# EAGLE design Transmitter PCB (EAGLE 9.6.2)
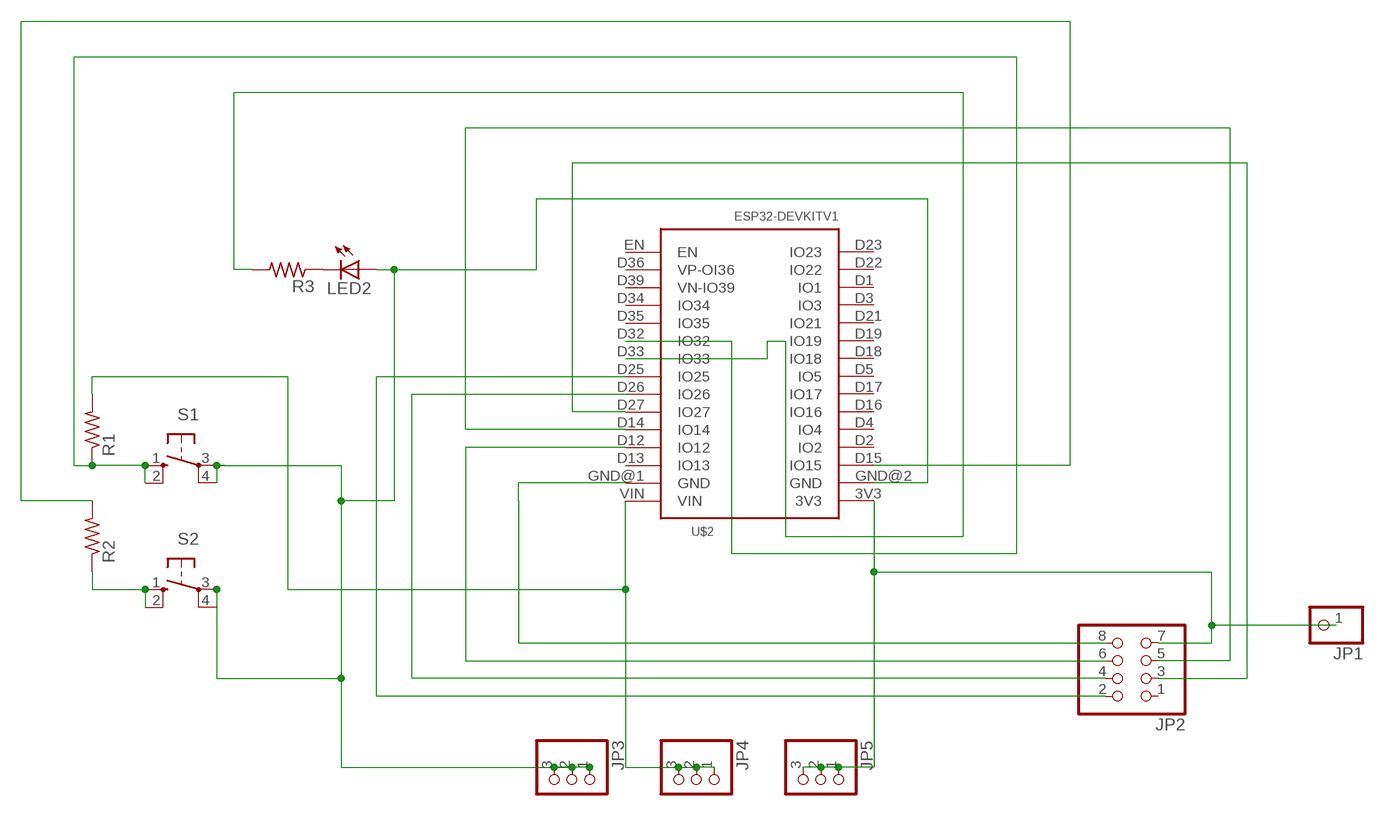
[diagram p0: schematic, sheet 1]

## Parts
JP1  PINHD-1X1  [1X01]
JP2  PINHD-2X4  [2X04]
JP3  PINHD-1X3  [1X03]
JP4  PINHD-1X3  [1X03]
JP5  PINHD-1X3  [1X03]
LED2  LED5MM  [LED5MM]
R1  R-US_0207/7  [0207/7]
R2  R-US_0207/7  [0207/7]
R3  R-US_0207/7  [0207/7]
S1  10-XX  [B3F-10XX]
S2  10-XX  [B3F-10XX]
U$2  ESP32DEVKITV1  [ESP32-DEVKITV1]

## Nets
GND: JP2.8 U$2.GND@1(GND)
LED2: R3.2 U$2.D33(IO33)
N$1: R2.1 S2.1(S) S2.2(S1)
N$2: JP3.1 JP3.2 JP3.3 LED2.A S1.3(P) S1.4(P1) S2.3(P) S2.4(P1) U$2.GND@2(GND)
N$3: JP2.4 U$2.D26(IO26)
N$4: JP2.2 U$2.D25(IO25)
N$6: JP1.1 JP2.7 JP5.1 JP5.2 JP5.3 U$2.3V3
N$7: JP2.3 U$2.D27(IO27)
N$8: LED2.K(C) R3.1
N$9: JP2.6 U$2.D12(IO12)
N$10: JP2.5 U$2.D14(IO14)
N$11: R2.2 U$2.D15(IO15)
RST: R1.1 S1.1(S) S1.2(S1) U$2.D32(IO32)
VCC: JP4.1 JP4.2 JP4.3 R1.2 U$2.VIN
Unconnected: JP2.1 U$2.D1(IO1) U$2.D2(IO2) U$2.D3(IO3) U$2.D4(IO4) U$2.D5(IO5) U$2.D13(IO13) U$2.D16(IO16) U$2.D17(IO17) U$2.D18(IO18) U$2.D19(IO19) U$2.D21(IO21) U$2.D22(IO22) U$2.D23(IO23) U$2.D34(IO34) U$2.D35(IO35) U$2.D36(VP-OI36) U$2.D39(VN-IO39) U$2.EN

## Library data of the parts
JP1 = adafruit:PINHD-1X1: Pin header 1x1 for 0.1" spacing With round pins
JP2 = adafruit:PINHD-2X4: PIN HEADER
JP3-JP5 = adafruit:PINHD-1X3: PIN HEADER
LED2 = adafruit:LED: LED OSRAM: - CHIPLED LG R971, LG N971, LY N971, LG Q971, LY Q971, LO R971, LY R971 LH N974, LH R974 LS Q976, LO Q976, LY Q976 LO Q996 - Hyper CHIPLED LW Q18S LB Q993, LB Q99A, LB R99A - SideLED LS A670, LO A670, LY A670, LG A670, LP A670 LB A673, LV A673, LT A673, LW A673 LH A674 LY A675 LS A676, LA A676, LO A676, LY A676, LW A676 LS A679, LY A679, LG A679 - Hyper Micro SIDELED® LS Y876, LA Y876, LO Y876, LY Y876 LT Y87S - SmartLED LW L88C, LW L88S LB L89C, LB L89S, LG L890 LS L89K, LO L89K, LY L89K LS L896, LA L896, LO L896, LY L896 - TOPLED LS T670, LO T670, LY T670, LG T670, LP T670 LSG T670, LSP T670, LSY T670, LOP T670, LYG T670 LG T671, LOG T671, LSG T671 LB T673, LV T673, LT T673, LW T673 LH T674 LS T676, LA T676, LO T676, LY T676, LB T676, LH T676, LSB T676, LW T676 LB T67C, LV T67C, LT T67C, LS T67K, LO T67K, LY T67K, LW E67C LS E67B, LA E67B, LO E67B, LY E67B, LB E67C, LV E67C, LT E67C LW T67C LS T679, LY T679, LG T679 LS T770, LO T770, LY T770, LG T770, LP T770 LB T773, LV T773, LT T773, LW T773 LH T774 LS E675, LA E675, LY E675, LS T675 LS T776, LA T776, LO T776, LY T776, LB T776 LHGB T686 LT T68C, LB T68C - Hyper Mini TOPLED® LB M676 - Mini TOPLED Santana® LG M470 LS M47K, LO M47K, LY M47K Source: http://www.osram.convergy.de/
R1-R3 = adafruit:R-US_: RESISTOR, American symbol
S1 S2 = switch-omron:10-XX: OMRON SWITCH; MPN: B3F-1000; OC_FARNELL: 176432; OC_NEWARK: 36M3542
U$2 = ESP32-DEVKITV1 (1):ESP32DEVKITV1

## Board
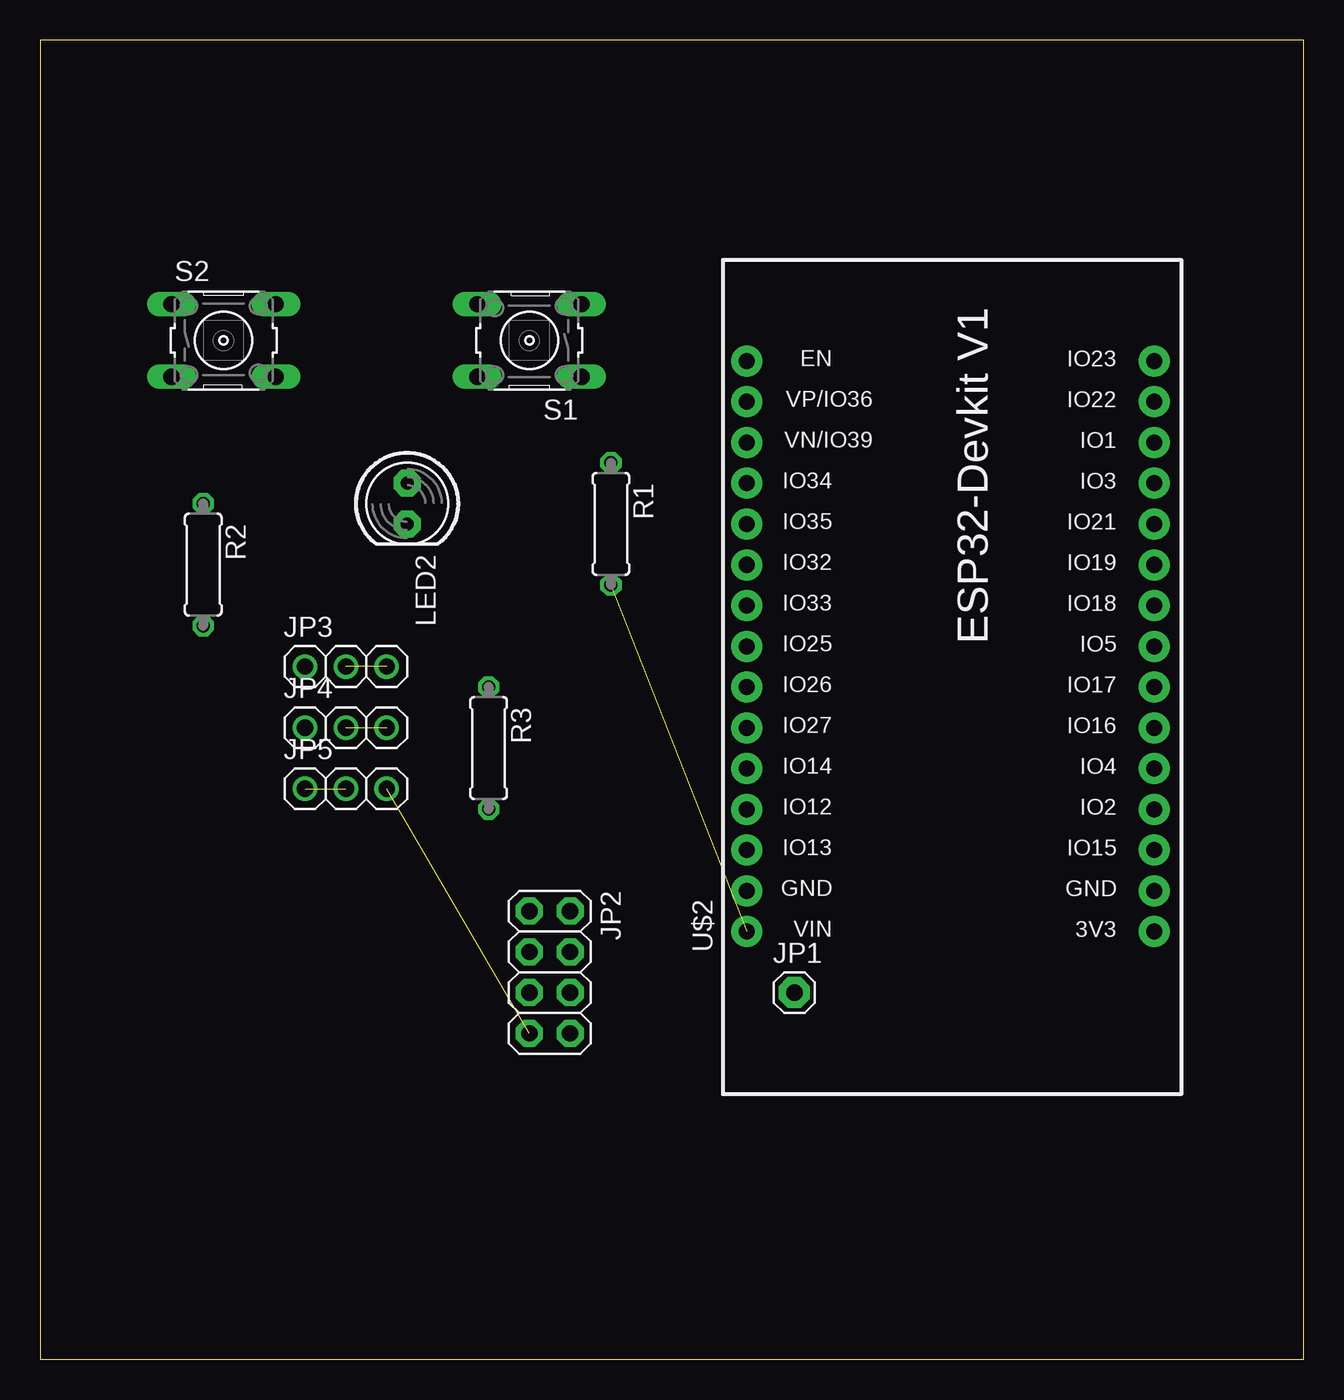
[diagram p1: board, top side]
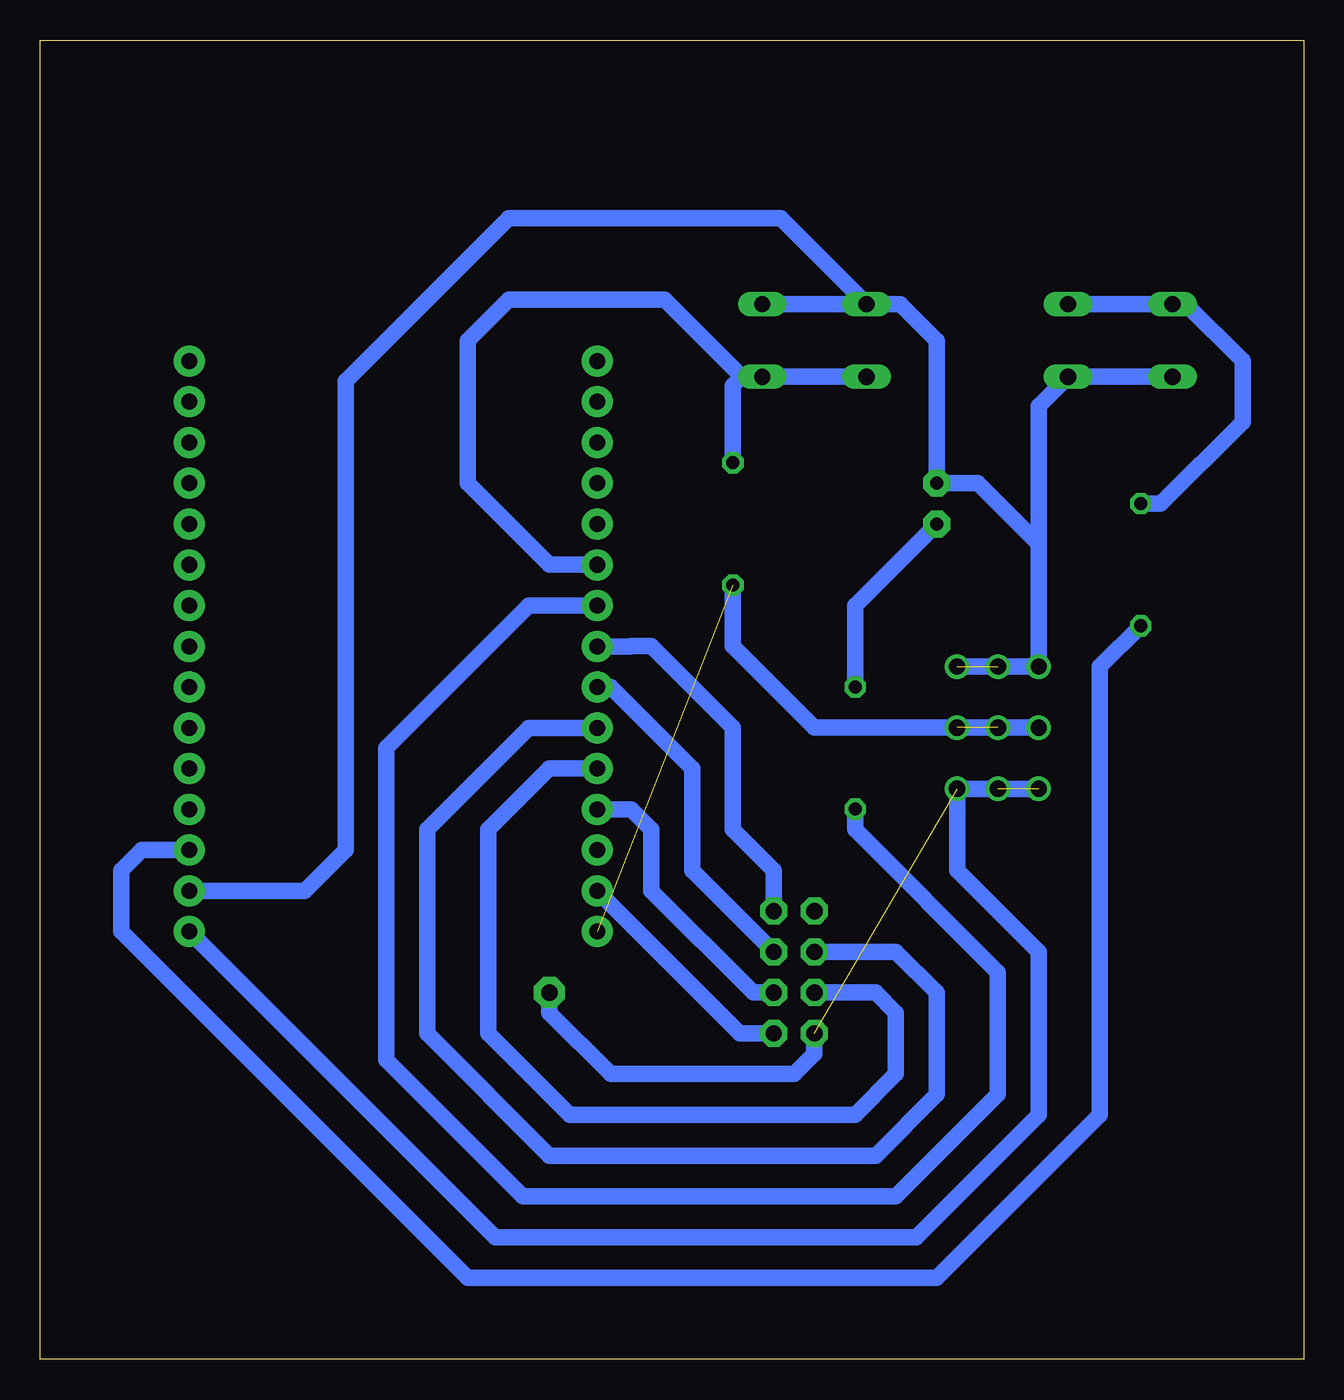
[diagram p2: board, bottom side, seen from below]

Size 78.72 x 82.22 mm. Coordinates in mm from the lower left corner, seen from the top.
Outline: 0,0 78.72,0 78.72,82.22 0,82.22 0,0
Copper layers (1*16): Top 0.035mm / dielectric 1.5mm / Bottom 0.035mm
Design rules "default": minimum track width 6mil, minimum drill 0.35mm, track to track 6mil, track to pad 6mil, pad to pad 6mil, via to via 6mil, smd to smd 6mil, copper to edge 40mil, drill to drill 6mil, minimum pad ring 10mil, minimum via ring 8mil, stop-mask expansion 4mil, vias tented up to drill 0mil, thermal gap 10mil

### Footprints (pad centres in the part's own frame; a part is rotated, then mirrored left to right if it is on the bottom)
1X01 = drill 1.016 pad 1.93 octagon: 1 0,0
2X04 = drill 1.016 pad 1.676 octagon: 1 -3.81,-1.27; 2 -3.81,1.27; 3 -1.27,-1.27; 4 -1.27,1.27; 5 1.27,-1.27; 6 1.27,1.27; 7 3.81,-1.27; 8 3.81,1.27
1X03 = drill 1.016: 1 -2.54,0; 2 0,0; 3 2.54,0
LED5MM = drill 0.813 pad 1.676 octagon: A -1.27,0; K 1.27,0
0207/7 = drill 0.813 octagon: 1 -3.81,0; 2 3.81,0
B3F-10XX = drill 1.016 long: 1 -3.251,2.261; 2 3.251,2.261; 3 -3.251,-2.261; 4 3.251,-2.261
ESP32-DEVKITV1 = drill 1 pad 1.93: 3V3 -16.52,-12.27; D1 13.96,-12.27; D2 -8.9,-12.27; D3 11.42,-12.27; D4 -6.36,-12.27; D5 1.26,-12.27; D12 -8.9,13.135; D13 -11.44,13.135; D14 -6.36,13.135; D15 -11.44,-12.27; D16 -3.82,-12.27; D17 -1.28,-12.27; D18 3.8,-12.27; D19 6.34,-12.27; D21 8.88,-12.27; D22 16.5,-12.27; D23 19.04,-12.27; D25 1.26,13.135; D26 -1.28,13.135; D27 -3.82,13.135; D32 6.34,13.135; D33 3.8,13.135; D34 11.42,13.135; D35 8.88,13.135; D36 16.5,13.135; D39 13.96,13.135; EN 19.04,13.135; GND@1 -13.98,13.135; GND@2 -13.98,-12.27; VIN -16.52,13.135

### Placement (x,y rotation side)
JP1  46.99,22.86 0 top
JP2  31.75,24.13 270 top
JP3  19.05,43.18 0 top
JP4  19.05,39.37 0 top
JP5  19.05,35.56 0 top
LED2  22.86,53.34 270 top
R1  35.56,52.07 270 top
R2  10.16,49.53 270 top
R3  27.94,38.1 270 top
S1  30.48,63.5 180 top
S2  11.43,63.5 0 top
U$2  57.15,43.18 90 top

### Tracks (layer width: path | path; a pad name or v marks a point on that pad's centre or on a via)
GND
  Bottom 1.016: U$2.GND@1 35.13,20.32 JP2.8
LED2
  Bottom 1.016: R3.2 27.94,33.02 19.05,24.13 19.05,16.51 25.4,10.16 48.64,10.16 57.15,18.67 57.15,38.1 48.27,46.98 U$2.D33
N$1
  Bottom 1.016: R2.1 8.89,53.34 3.81,58.42 3.81,62.23 7.34,65.76 S2.1 S2.2
N$2  (1 unrouted)
  Bottom 1.016: S1.4 25.12,65.76 22.86,63.5 LED2.A 20.32,54.61 16.51,50.8 | 16.51,50.8 JP3.1 JP3.3 | S1.4 32.59,71.12 49.53,71.12 59.69,60.96 59.69,31.75 62.24,29.2 U$2.GND@2 | 16.51,50.8 16.51,59.41 S2.4 S2.3 | S1.4 S1.3
N$3
  Bottom 1.016: JP2.4 38.1,30.48 38.1,36.83 43.17,41.9 U$2.D26
N$4
  Bottom 1.016: U$2.D25 41.92,44.44 41.91,44.45 40.64,44.45 35.56,39.37 35.56,33.02 33.02,30.48 JP2.2
N$6  (2 unrouted)
  Bottom 1.016: JP2.7 30.48,19.05 31.75,17.78 43.18,17.78 46.99,21.59 JP1.1 | JP5.1 JP5.3 21.59,30.48 16.51,25.4 16.51,15.24 24.13,7.62 50.38,7.62 U$2.3V3
N$7
  Bottom 1.016: JP2.3 25.4,25.4 22.86,22.86 22.86,16.51 26.67,12.7 46.99,12.7 54.61,20.32 54.61,33.02 48.27,39.36 U$2.D27
N$8
  Bottom 1.016: LED2.K 27.94,46.99 R3.1
N$9
  Bottom 1.016: JP2.6 34.29,22.86 40.64,29.21 40.64,33.02 41.9,34.28 U$2.D12
N$10
  Bottom 1.016: U$2.D14 47,36.82 50.8,33.02 50.8,20.32 45.72,15.24 27.94,15.24 25.4,17.78 25.4,21.59 26.67,22.86 JP2.5
N$11
  Bottom 1.016: R2.2 12.7,43.18 12.7,15.24 22.86,5.08 52.07,5.08 73.66,26.67 73.66,30.48 72.39,31.75 72.38,31.74 U$2.D15
RST
  Bottom 1.016: R1.1 35.56,60.68 35,61.24 | 35,61.24 39.8,66.04 49.53,66.04 52.07,63.5 52.07,54.61 46.99,49.53 44.02,49.53 U$2.D32 | 35,61.24 S1.1 S1.2
VCC  (2 unrouted)
  Bottom 1.016: JP4.1 JP4.3 30.48,39.37 35.56,44.45 R1.2